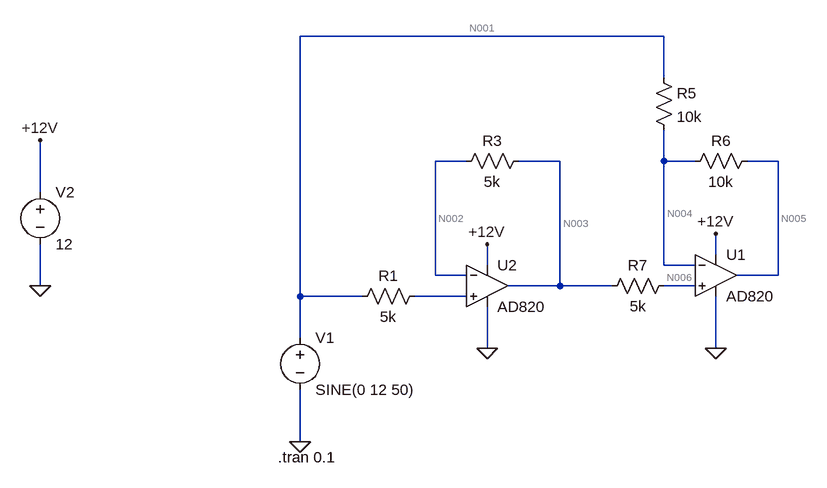
[diagram p0: schematic absolut_value_circuit.asc]
absolut_value_circuit.asc, the LTspice schematic file:
Version 4
SHEET 1 880 680
WIRE 384 -240 -176 -240
WIRE 384 -176 384 -240
WIRE 80 -48 32 -48
WIRE 224 -48 160 -48
WIRE 384 -48 384 -96
WIRE 432 -48 384 -48
WIRE 560 -48 512 -48
WIRE -576 0 -576 -80
WIRE 464 96 464 64
WIRE 112 112 112 80
WIRE 384 112 384 -48
WIRE 432 112 384 112
WIRE 32 128 32 -48
WIRE 80 128 32 128
WIRE 560 128 560 -48
WIRE 560 128 496 128
WIRE -576 144 -576 80
WIRE 224 144 224 -48
WIRE 224 144 144 144
WIRE 304 144 224 144
WIRE 432 144 384 144
WIRE -176 160 -176 -240
WIRE -80 160 -176 160
WIRE 80 160 0 160
WIRE -176 224 -176 160
WIRE 112 240 112 176
WIRE 464 240 464 160
WIRE -176 384 -176 304
FLAG -176 384 0
FLAG 112 240 0
FLAG -576 144 0
FLAG -576 -80 +12V
FLAG 112 80 +12V
FLAG 464 240 0
FLAG 464 64 +12V
SYMBOL voltage -176 208 R0
WINDOW 123 24 124 Left 2
WINDOW 39 0 0 Left 0
SYMATTR InstName V1
SYMATTR Value SINE(0 12 50)
SYMBOL res 176 -64 R90
WINDOW 0 0 56 VBottom 2
WINDOW 3 32 56 VTop 2
SYMATTR InstName R3
SYMATTR Value 5k
SYMBOL voltage -576 -16 R0
WINDOW 123 0 0 Left 0
WINDOW 39 0 0 Left 0
SYMATTR InstName V2
SYMATTR Value 12
SYMBOL Opamps\\AD820 112 80 R0
SYMATTR InstName U2
SYMBOL Opamps\\AD820 464 64 R0
SYMATTR InstName U1
SYMBOL res 528 -64 R90
WINDOW 0 0 56 VBottom 2
WINDOW 3 32 56 VTop 2
SYMATTR InstName R6
SYMATTR Value 10k
SYMBOL res 400 128 R90
WINDOW 0 0 56 VBottom 2
WINDOW 3 32 56 VTop 2
SYMATTR InstName R7
SYMATTR Value 5k
SYMBOL res 368 -192 R0
SYMATTR InstName R5
SYMATTR Value 10k
SYMBOL res 16 144 R90
WINDOW 0 0 56 VBottom 2
WINDOW 3 32 56 VTop 2
SYMATTR InstName R1
SYMATTR Value 5k
TEXT -210 408 Left 2 !.tran 0.1

The netlist it stands for:
* absolut_value_circuit.asc
V1 N001 0 SINE(0 12 50)
R3 N003 N002 5k
V2 +12V 0 12
XU2 N007 N002 +12V 0 N003 AD820  ; pins In+ In- V+ V- OUT
XU1 N006 N004 +12V 0 N005 AD820  ; pins In+ In- V+ V- OUT
R6 N005 N004 10k
R7 N006 N003 5k
R5 N001 N004 10k
R1 N007 N001 5k
.tran 0.1
.backanno
.end

* Results of the author's LTspice run, read from the files saved beside the schematic
* Operating Point, zero values left out:
*   V(n003) = 703.5 µV
*   V(n002) = 703.5 µV
*   V(+12v) = 12 V
*   V(n004) = 1.184 mV
*   V(n006) = 703.5 µV
*   V(n005) = 2.367 mV
*   I(R5) = -118.4 nA
*   I(R6) = 118.4 nA
*   I(V2) = -1.412 mA
*   I(V1) = 118.4 nA
*   Ix(u2:3) = 706 µA
*   Ix(u2:4) = -706 µA
*   Ix(u1:3) = 706 µA
*   Ix(u1:4) = -706.1 µA
*   Ix(u1:5) = -118.4 nA
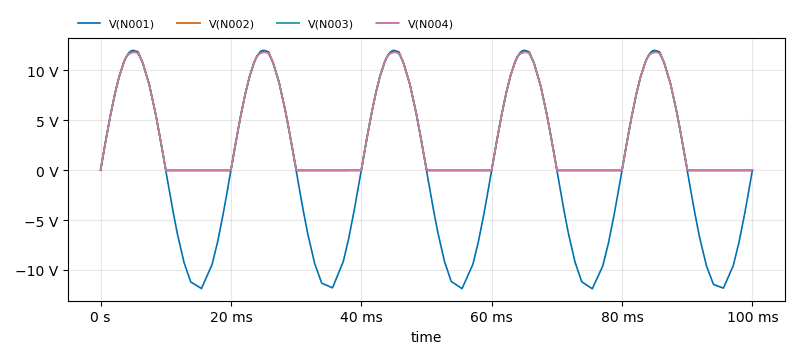
[diagram p1: Transient Analysis of absolut_value_circuit.asc, plotted from the saved traces]
* Transient Analysis, 1 run:
*   V(N001): min -11.89 V, max 12 V, average 42.1 mV, rms 8.445 V, last 0 V
*   V(N002): min -28.28 mV, max 11.89 V, average 3.789 V, rms 5.996 V, last -17.57 mV
*   V(N003): min -28.28 mV, max 11.89 V, average 3.789 V, rms 5.996 V, last -17.55 mV
*   V(N004): min -28.57 mV, max 11.8 V, average 3.784 V, rms 5.986 V, last -1.826 mV